# Altium project Battery_Mnitor1.PrjPcb
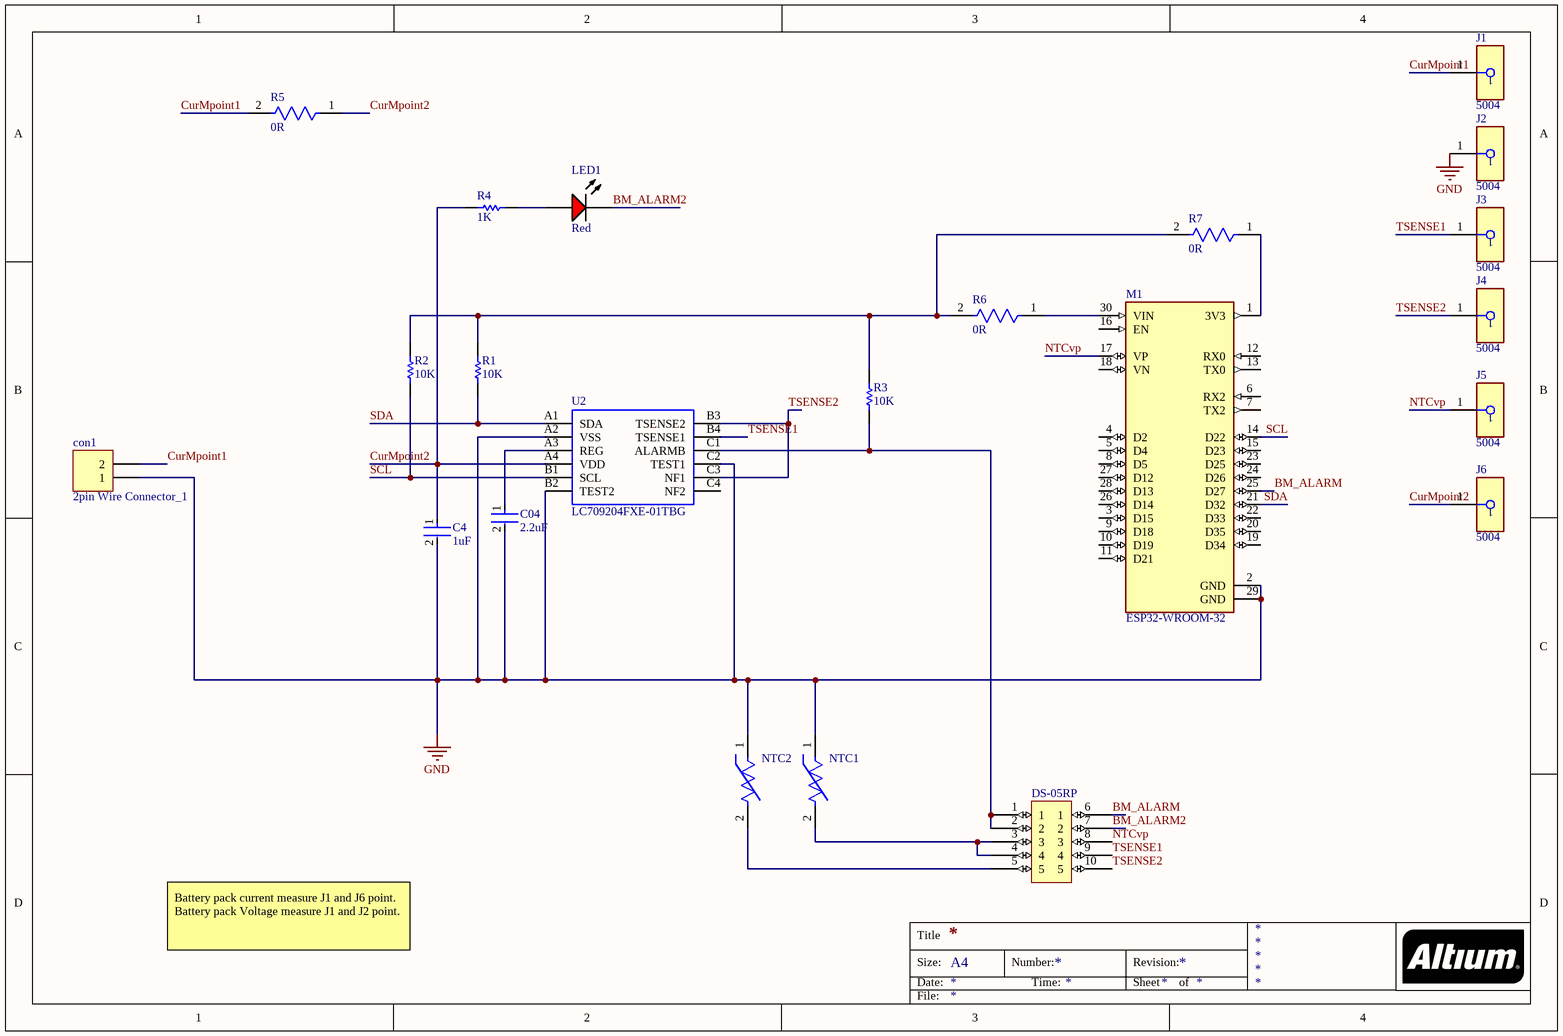
[diagram p0: Battery_Mnitor1.SchDoc]
1 sheet, 22 parts. Net scope: global (net labels, ports and power ports of the same name join across sheets).
Board file: Battery_Mnitor1.PcbDoc

## Sheet Battery_Mnitor1.SchDoc
size A4

### Parts
C04  2.2uF  [FP-CL826-IPC_C]
C4  1uF  [FP-CL542-IPC_C]
con1  2pin Wire Connector_1  [HDR1X2H]
DS-05RP  Dip Switch  [DIP10]  (value not drawn)
J1  5004  [FP-5004-MFG]
J2  5004  [FP-5004-MFG]
J3  5004  [FP-5004-MFG]
J4  5004  [FP-5004-MFG]
J5  5004  [FP-5004-MFG]
J6  5004  [FP-5004-MFG]
LED1  Red  [VISH-TLMX1100_V]
M1  ESP32-WROOM-32  [ESP32-DEVKIT-V1]
NTC1  NXRT15XH103FA1B030  [FP-NXR_151B030-MFG]  (value not drawn)
NTC2  NXRT15XH103FA1B030  [FP-NXR_151B030-MFG]  (value not drawn)
R1  10K  [RESC1005X40X25LL05T10]
R2  10K  [RESC1005X40X25LL05T10]
R3  10K  [RESC1005X40X25LL05T10]
R4  1K  [RESC1005X40X25LL05T10]
R5  0R  [FP-RC0402-0_4-IPC_A]
R6  0R  [FP-RC0402-0_4-IPC_A]
R7  0R  [FP-RC0402-0_4-IPC_A]
U2  LC709204FXE-01TBG  [BGA12C40P4X3_191X148X51]

### Nets
GND: C04.2 C4.2 con1.1 J2.1 M1.2(GND) M1.29(GND) NTC1.1 NTC2.1 U2.A2(VSS) U2.B2(TEST2) U2.C2(TEST1)
BM_ALARM: DS-05RP.6(1) M1.25(D27)
BM_ALARM2: DS-05RP.7(2) LED1.2(K)
CurMpoint1: con1.2 J1.1 R5.2
CurMpoint2: C4.1 J6.1 R4.2 R5.1 U2.A4(VDD)
NTCvp: DS-05RP.8(3) J5.1 M1.17(VP)
SCL: M1.14(D22) R2.2 U2.B1(SCL)
SDA: M1.21(D32) R1.2 U2.A1(SDA)
TSENSE1: DS-05RP.9(4) J3.1 U2.B4(TSENSE1)
TSENSE2: DS-05RP.10(5) J4.1 U2.B3(TSENSE2) U2.C3(NF1)
NetC04_1: C04.1 U2.A3(REG)
NetDS-05RP_1: DS-05RP.1 DS-05RP.2 R3.2 U2.C1(ALARMB)
NetDS-05RP_3: DS-05RP.3 DS-05RP.4 NTC1.2
NetDS-05RP_5: DS-05RP.5 NTC2.2
NetLED1_1: LED1.1(A) R4.1
NetM1_1: M1.1(3V3) R7.1
NetM1_30: M1.30(VIN) R6.1
NetR1_1: R1.1 R2.1 R3.1 R6.2 R7.2

Not connected (* = marked no-connect by the designer): M1 3(D15) 4(D2) 5(D4) 6(RX2) 7(TX2) 8(D5) 9(D18) 10(D19) 11(D21) 12(RX0) 13(TX0) 15(D23) 16(EN) 18(VN) 19(D34) 20(D35) 22(D33) 23(D25) 24(D26) 26(D14) 27(D12) 28(D13); U2 C4(NF2)

### Notes on the sheet
- Battery pack current measure J1 and J6 point. Battery pack Voltage measure J1 and J2 point.
- Title
- Size:
- Date:
- A4
- Number:
- Time:
- Revision:
- Sheet
- of
- File:

### Library data of the parts
C04 = CMP-13271-001859-1: Cap Ceramic 2.2uF 25V X5R ±20% SMD 0402 +85°C Paper T/R; Mfr. Part #: CL05A225MA5NUNC; Manufacturer: Samsung Electro-Mechanics; Mount: Surface Mount; Case Code (Metric): 1005; Case Code (Imperial): 0402; Width: 0.02inch; Lead Free: Lead Free; Packaging: Cut Tape; Package: 0402; Min Operating Temperature: -55°C; Thickness: 0.022inch; Voltage: 25V; Max Operating Temperature: 85°C; Length: 0.039inch; Capacitance: 2.2uF; Tolerance: 20%; LCSC Part #: C159814
C4 = CMP-13271-001051-1: Cap Ceramic 1uF 25V X5R ±10% SMD 0402 +85°C Paper T/R; Mfr. Part #: CL05A105KA5NQNC; Manufacturer: Samsung Electro-Mechanics; Capacitance: 1uF; Voltage Rating: 25V; Package: 0402; Tolerance: 10%; LCSC Part #: C52923
con1 = Header 2H: Header, 2-Pin, Right Angle; LatestRevisionDate: 17-Jul-2002; LatestRevisionNote: Re-released for DXP Platform.; Publisher: Altium Limited
DS-05RP = Component_1: SPST 24V 25mA Red -20℃~+70℃ 3000 Flat dial, raised type 2.54mm 6 Plugin DIP Switches ROHS; Manufacturer: Korean Hroparts Elec; Mfr. Part #: DS-05RP; LCSC Part #: C129061; Package: Plugin
J1-J6 = CMP-2000-05575-2: PC TEST POINT MINIATURE YELLOW; Manufacturer: Keystone; Number Of Contacts: 1; Is Female: yes; Device Class L1: Connectors; Mfr. Part #: 5004; Digikey Description: PC TEST POINT MINIATURE YELLOW; ComponentLink2URL: https://www.keyelco.com/product-pdf.cfm?p=1313; Lead Free: Yes; ComponentLink2Description: Datasheet; Category: Conn; Height: 4.72mm; Octopart: https://octopart.com/5004-keystone-28591; Mouser Description: TEST POINT PC MINI .040"D YELLOW; Device Class L3: unset; Contact Material: Silver; Package: 5004; Automotive: No; Device Class L2: unset; RoHS: TRUE; LCSC Part #: C2906762
  J1 J5 J6: Parameter 2: *
LED1 = CMP-1666-00027-1: LED, RED, 2.1 V, -40 to 100 degC, 2-Pin SMD (0603), RoHS, Tape and Reel; Manufacturer: Vishay; Mfr. Part #: TLMS1100-GS08; Type (Capacitors): C0G; Capacitance: 12 pF; Voltage Rating: 50 V; Tolerance: 5%; ComponentLink2Description: Datasheet; ComponentLink1URL: http://www.vishay.com/; Width: 0.8 mm; ComponentLink2URL: http://www.vishay.com/docs/83173/tlmb1100.pdf; Package: 0603; ComponentLink1Description: Manufacturer URL; Height: 0.8 mm; Length: 1.6 mm; PackageDescription: 2-Pin Surface Mount Device, Body 1.6 x 0.8 mm; DatasheetVersion: Rev. 2.7, 03/2016; Voltage Rating (DC): 50 V; Radiation Hardening: No; Color: Red; LCSC Part #: C266784
M1 = ESP32-DEVKIT-V1: Dual core, Wi-Fi: 2.4 GHz up to 150 Mbits/s,BLE (Bluetooth Low Energy) and legacy Bluetooth, 32 bits, Up to 240 MHz
NTC1 NTC2 = CMP-06022-001050-1: Thermistor NTC 10kΩ ±1% 2-Pin Radial Bulk; Manufacturer: Murata Electronics; Resistance: 10kR; Max Power Dissipation: 7.5mW; Lead Diameter: 0.4mm; RoHS Compliant: Yes; Number of Pins: 2; Lead Free: Lead Free; Height: 2mm; Lead Pitch: 2.5mm; Power Rating: 7.5mW; Series: NXR; Packaging: Bulk; Package Quantity: 500; Width: 4mm; Max Operating Temperature: 125°C; Termination: Radial; Min Operating Temperature: -40°C; Tolerance: 1%; Resistance Tolerance: 1%; Length: 5mm; Mount: Through Hole; LCSC Part #: C152559; Mfr. Part #: NXRT15XH103FA1B030; Package: Radial Leaded
R1-R3 = CMP-2002-07353-1: 62.5mW Thick Film Resistors 50V ±100ppm/℃ ±1% -55℃~+155℃ 10kΩ 0402 Chip Resistor - Surface Mount ROHS; Mfr. Part #: RC0402FR-0710KL; Manufacturer: Yageo / Phycomp; Power: 1/16W; LCSC Part #: C60490; Package: 0402; Resistance: 10K; Tolerance: ±1%
R4 = CMP-2002-07941-1: 62.5mW 50V ±100ppm/℃ ±5% -55℃~+155℃ 1kΩ 0402 Chip Resistor - Surface Mount ROHS; Mfr. Part #: RC0402JR-071KL; Manufacturer: Yageo / Phycomp; LCSC Part #: C105637; Package: 0402; Value: 1K; Resistance: 1K
R5-R7 = CMP-2002-07342-2: RES SMD 0 OHM JUMPER 1/16W 0402; Mfr. Part #: RC0402FR-070RL; Manufacturer: YAGEO; Temperature Coefficient: 200ppm/°C; Tolerance: 1%; Power Rating: 62.5mW; Voltage Rating: 50V; Resistance: 0R; Series: RC; RoHS Compliant: Yes; Resistor Type: Thick Film; Number of Terminations: 2; Package: 0402; Size Code: 0402; Termination: SMD/SMT; Max Operating Temperature: 155°C; Width: 0.5mm; Mount: Surface Mount; Lead Free: Lead Free; Packaging: Tape and Reel; Radiation Hardening: No; LCSC Part #: C106231
U2 = LC709204FXE-01TBG: Battery Management FUEL GAUGE; Manufacturer: onsemi; Geometry.Height: 0.51mm; Mfr. Part #: LC709204FXE-01TBG; Mouser Part Number: 863-LC709204FXE01TBG; Mouser Price/Stock: https://www.mouser.co.uk/ProductDetail/onsemi/LC709204FXE-01TBG?qs=xZ%2FP%252Ba9zWqZEcFBJqR18FQ%3D%3D; Arrow Part Number: *; Arrow Price/Stock: *; Package: WLCSP12(1.48x1.91x0.51); Mouser Testing Price/Stock: *; Datasheet Link: https://datasheet.datasheetarchive.com/originals/distributors/Datasheets_SAMA/fe717287e81a719257576d7f98eba387.pdf; LCSC Part #: C895466